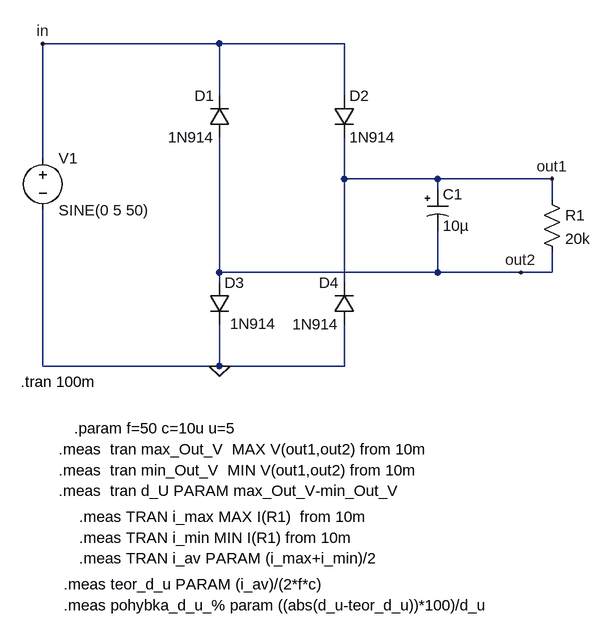
[diagram p0: schematic 2_Двонапівперіодний випрямляч.asc]
2_Двонапівперіодний випрямляч.asc, the LTspice schematic file:
Version 4
SHEET 1 880 832
WIRE 112 -48 -160 -48
WIRE 304 -48 112 -48
WIRE 112 32 112 -48
WIRE 304 32 304 -48
WIRE -160 128 -160 -48
WIRE 304 160 304 96
WIRE 448 160 304 160
WIRE 624 160 448 160
WIRE 448 176 448 160
WIRE 624 192 624 160
WIRE 112 304 112 96
WIRE 448 304 448 240
WIRE 448 304 112 304
WIRE 576 304 448 304
WIRE 624 304 624 272
WIRE 624 304 576 304
WIRE 112 320 112 304
WIRE 304 320 304 160
WIRE -160 448 -160 208
WIRE 112 448 112 384
WIRE 112 448 -160 448
WIRE 304 448 304 384
WIRE 304 448 112 448
FLAG 112 448 0
FLAG 624 160 out1
FLAG 576 304 out2
FLAG -160 -48 in
SYMBOL voltage -160 112 R0
WINDOW 123 0 0 Left 2
WINDOW 39 0 0 Left 2
SYMATTR InstName V1
SYMATTR Value SINE(0 5 50)
SYMBOL diode 128 96 R180
WINDOW 0 24 64 Left 2
WINDOW 3 24 0 Left 2
SYMATTR InstName D1
SYMATTR Value 1N914
SYMBOL diode 288 32 R0
SYMATTR InstName D2
SYMATTR Value 1N914
SYMBOL diode 96 320 R0
WINDOW 3 32 63 Left 2
SYMATTR InstName D3
SYMATTR Value 1N914
SYMBOL diode 320 384 R180
WINDOW 0 24 64 Left 2
WINDOW 3 24 0 Left 2
SYMATTR InstName D4
SYMATTR Value 1N914
SYMBOL polcap 432 176 R0
WINDOW 3 24 56 Left 2
SYMATTR InstName C1
SYMATTR Value 10µ
SYMATTR Description Capacitor
SYMATTR Type cap
SYMATTR SpiceLine V=16 Irms=3.72678 Rser=0.018 Lser=0
SYMBOL res 608 176 R0
SYMATTR InstName R1
SYMATTR Value 20k
TEXT -194 472 Left 2 !.tran 100m
TEXT -112 544 Left 2 !.param f=50 c=10u u=5
TEXT -136 576 Left 2 !.meas  tran max_Out_V  MAX V(out1,out2) from 10m
TEXT -136 608 Left 2 !.meas  tran min_Out_V  MIN V(out1,out2) from 10m
TEXT -136 640 Left 2 !.meas  tran d_U PARAM max_Out_V-min_Out_V
TEXT -104 680 Left 2 !.meas TRAN i_max MAX I(R1)  from 10m
TEXT -104 712 Left 2 !.meas TRAN i_min MIN I(R1) from 10m
TEXT -104 744 Left 2 !.meas TRAN i_av PARAM (i_max+i_min)/2
TEXT -128 784 Left 2 !.meas teor_d_u PARAM (i_av)/(2*f*c)
TEXT -128 816 Left 2 !.meas pohybka_d_u_% param ((abs(d_u-teor_d_u))*100)/d_u

The netlist it stands for:
* 2_Двонапівперіодний випрямляч.asc
V1 in 0 SINE(0 5 50)
D1 out2 in 1N914
D2 in out1 1N914
D3 out2 0 1N914
D4 0 out1 1N914
C1 out1 out2 10µ V=16 Irms=3.72678 Rser=0.018 Lser=0
R1 out1 out2 20k
.model D D
.lib standard.dio
.tran 100m
.param f=50 c=10u u=5
.meas  tran max_Out_V  MAX V(out1,out2) from 10m
.meas  tran min_Out_V  MIN V(out1,out2) from 10m
.meas  tran d_U PARAM max_Out_V-min_Out_V
.meas TRAN i_max MAX I(R1)  from 10m
.meas TRAN i_min MIN I(R1) from 10m
.meas TRAN i_av PARAM (i_max+i_min)/2
.meas teor_d_u PARAM (i_av)/(2*f*c)
.meas pohybka_d_u_% param ((abs(d_u-teor_d_u))*100)/d_u
.backanno
.end

* Results of the author's LTspice run, read from the files saved beside the schematic
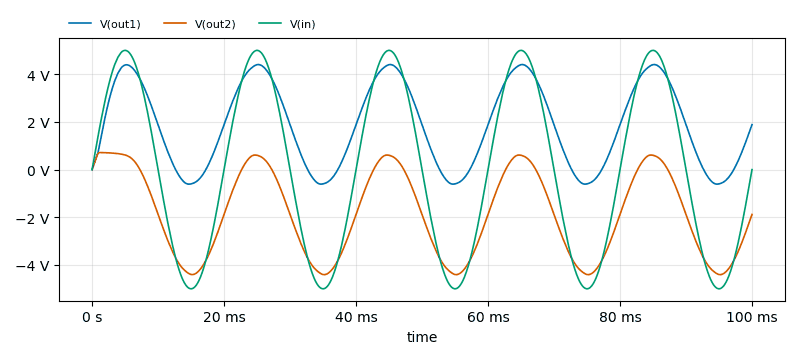
[diagram p1: Transient Analysis of 2_Двонапівперіодний випрямляч.asc, plotted from the saved traces]
* Transient Analysis, 1 run:
*   V(out1): min -611.2 mV, max 4.405 V, average 1.838 V, rms 2.546 V, last 1.882 V
*   V(out2): min -4.405 V, max 713.6 mV, average -1.838 V, rms 2.582 V, last -1.882 V
*   V(in): min -4.999 V, max 4.999 V, average -42.39 µV, rms 3.539 V, last 0 V
* From the log:
*   max_out_v: MAX(v(out1,out2))=3.8399 FROM 0.01 TO 0.1
*   min_out_v: MIN(v(out1,out2))=3.68178 FROM 0.01 TO 0.1
*   d_u: max_out_v-min_out_v=0.158127
*   i_max: MAX(i(r1))=0.000191995 FROM 0.01 TO 0.1
*   i_min: MIN(i(r1))=0.000184089 FROM 0.01 TO 0.1
*   i_av: (i_max+i_min)/2=0.000188042
*   teor_d_u: (i_av*(3/4))/(2*f*c)=0.141032
*   pohybka_d_u_%: ((abs(d_u-teor_d_u))*100)/d_u=10.8112